# EAGLE design pcb (EAGLE 9.2.2)
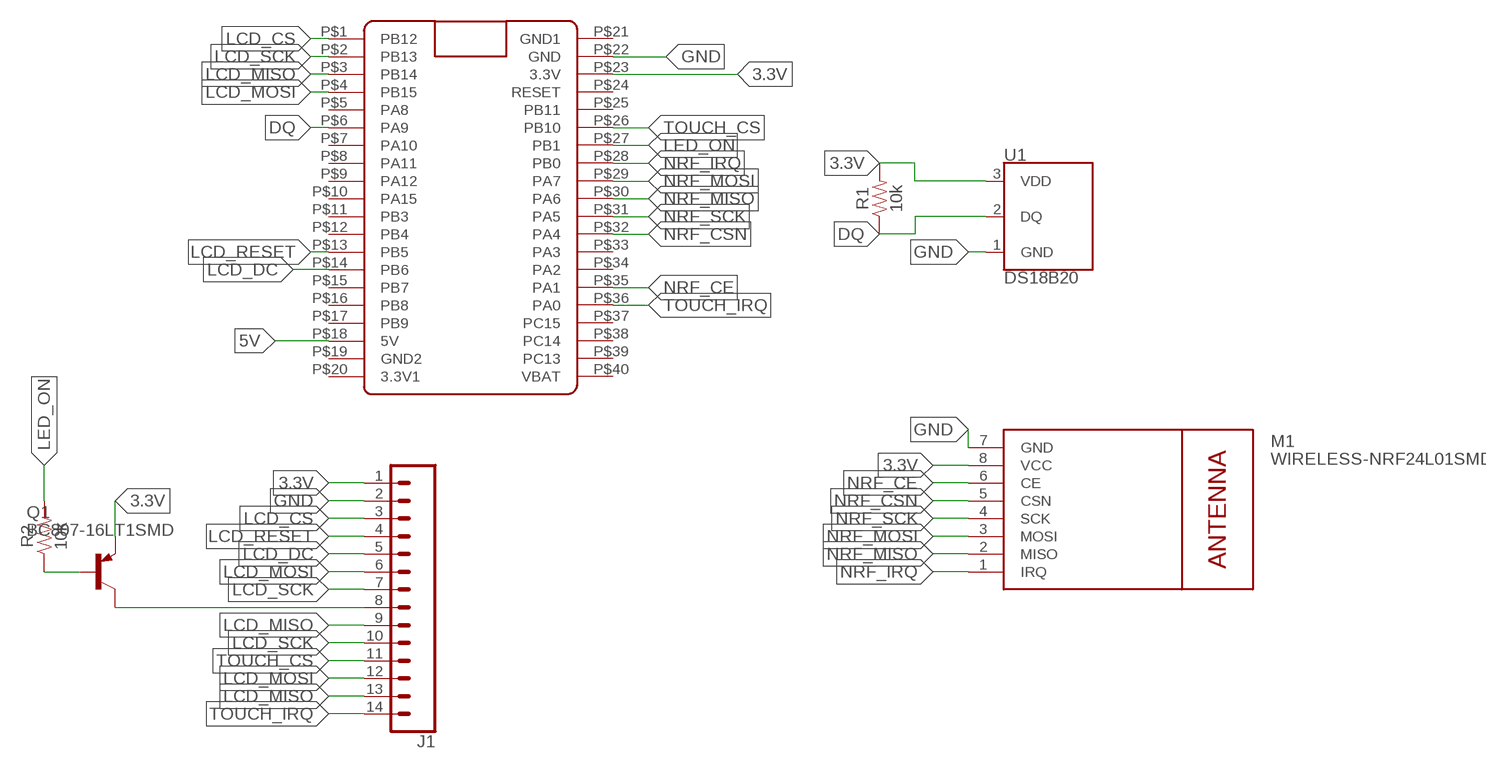
[diagram p0: schematic, sheet 1]

## Parts
J1  CONN_14  [1X14]
M1  WIRELESS-NRF24L01SMD  [WIRELESS-NRF24L01-SMD]
Q1  BC807-16LT1SMD  [SOT23-BEC]
R1  10k  10KOHM-0603-1/10W-1%  [0603]
R2  10k  10KOHM-0603-1/10W-1%  [0603]
U1  DS18B20  [TO-92-AMMO]
U$1  BLUE_PILL  [BLUE_PILL]

## Nets
3.3V: J1.1 M1.8(VCC) Q1.E R1.2 U1.3(VDD) U$1.P$23(3.3V)
5V: U$1.P$18(5V)
DQ: R1.1 U1.2(DQ) U$1.P$6(PA9)
GND: J1.2 M1.7(GND) U1.1(GND) U$1.P$22(GND)
LCD_CS: J1.3 U$1.P$1(PB12)
LCD_DC: J1.5 U$1.P$14(PB6)
LCD_MISO: J1.9 J1.13 U$1.P$3(PB14)
LCD_MOSI: J1.6 J1.12 U$1.P$4(PB15)
LCD_RESET: J1.4 U$1.P$13(PB5)
LCD_SCK: J1.7 J1.10 U$1.P$2(PB13)
LED_ON: R2.2 U$1.P$27(PB1)
N$1: Q1.B R2.1
N$3: J1.8 Q1.C
NRF_CE: M1.6(CE) U$1.P$35(PA1)
NRF_CSN: M1.5(CSN) U$1.P$32(PA4)
NRF_IRQ: M1.1(IRQ) U$1.P$28(PB0)
NRF_MISO: M1.2(MISO) U$1.P$30(PA6)
NRF_MOSI: M1.3(MOSI) U$1.P$29(PA7)
NRF_SCK: M1.4(SCK) U$1.P$31(PA5)
TOUCH_CS: J1.11 U$1.P$26(PB10)
TOUCH_IRQ: J1.14 U$1.P$36(PA0)
Unconnected: U$1.P$5(PA8) U$1.P$7(PA10) U$1.P$8(PA11) U$1.P$9(PA12) U$1.P$10(PA15) U$1.P$11(PB3) U$1.P$12(PB4) U$1.P$15(PB7) U$1.P$16(PB8) U$1.P$17(PB9) U$1.P$19(GND2) U$1.P$20(3.3V1) U$1.P$24(RESET) U$1.P$25(PB11) U$1.P$33(PA3) U$1.P$34(PA2) U$1.P$37(PC15) U$1.P$38(PC14) U$1.P$39(PC13) U$1.P$40(VBAT)

## Power pins joined to a net without a drawn wire
GND1: U$1.P$21(GND1)

## Library data of the parts
J1 = SparkFun-Connectors:CONN_14: Multi connection point. Often used as Generic Header-pin footprint for 0.1 inch spaced/style header connections On any of the 0.1 inch spaced packages, you can populate with these: Break Away Headers - Straight <https://www.sparkfun.com/products/116> (PRT-00116) Break Away Male Headers - Right Angle <https://www.sparkfun.com/products/553> (PRT-00553) Female Headers <https://www.sparkfun.com/products/115> (PRT-00115) Break Away Headers - Machine Pin <https://www.sparkfun.com/products/117> (PRT-00117) Break Away Female Headers - Swiss Machine Pin <https://www.sparkfun.com/products/743> (PRT-00743) For SCREWTERMINALS and SPRING TERMINALS visit here: Screw Terimnals on SparkFun.com <https://www.sparkfun.com/search/results?term=Screw+Terminals> (5mm/3.5mm/2.54mm spacing) This device is also useful as a general connection point to wire up your design to another part of your project. Our various solder wires solder well into these plated through hole pads. Hook-Up Wire - Assortment (Stranded, 22 AWG) <https://www.sparkfun.com/products/11375> (PRT-11375) Hook-Up Wire - Assortment (Solid Core, 22 AWG) <https://www.sparkfun.com/products/11367> (PRT-11367) View the entire wire category on our website here <https://www.sparkfun.com/categories/141> Special notes: Molex polarized connector foot print use with SKU : PRT-08231 with associated crimp pins and housings. 1MM SMD Version SKU: PRT-10208 NOTES ON THE VARIANTS LOCK and LOCK_LONGPADS... This footprint was designed to help hold the alignment of a through-hole component (i.e. 6-pin header) while soldering it into place. You may notice that each hole has been shifted either up or down by 0.005 of an inch from it's more standard position (which is a perfectly straight line). This slight alteration caused the pins (the squares in the middle) to touch the edges of the holes. Because they are alternating, it causes a "brace" to hold the component in place. 0.005 has proven to be the perfect amount of "off-center" position when using our standard breakaway headers. Although looks a little odd when you look at the bare footprint, once you have a header in there, the alteration is very hard to notice. Also,if you push a header all the way into place, it is covered up entirely on the bottom side.
M1 = nrf24l01plus:WIRELESS-NRF24L01: 2.4 GHz Wireless Module based on NRF24L01 chip
Q1 = transistor-pnp:BC807*: PNP Transistror
R1 R2 = SparkFun-Resistors:10KOHM: 10kΩ resistor A resistor is a passive two-terminal electrical component that implements electrical resistance as a circuit element. Resistors act to reduce current flow, and, at the same time, act to lower voltage levels within circuits. - Wikipedia; PROD_ID: RES-00824
U1 = DS18B20:DS18B20: Dallas/Maxim DS18B20 1-Wire Temperature Sensor The DS18B20 reports degrees C with 9 to 12-bit precision, -55C to 125C (+/-0.5C). Each sensor has a unique 64-Bit Serial number etched into it - allows for a huge number of sensors to be used on one data bus. Datasheet <http://datasheets.maximintegrated.com/en/ds/DS18B20.pdf> SparkFun Products One Wire Digital Temperature Sensor - DS18B20 <https://www.sparkfun.com/products/245> (SEN-00245); AVAILABILITY: Unavailable; MF: Maxim Integrated; MP: DS18B20; PACKAGE: TO-92 Maxim Integrated; PRICE: None
U$1 = BluePill:BLUE_PILL

## Board
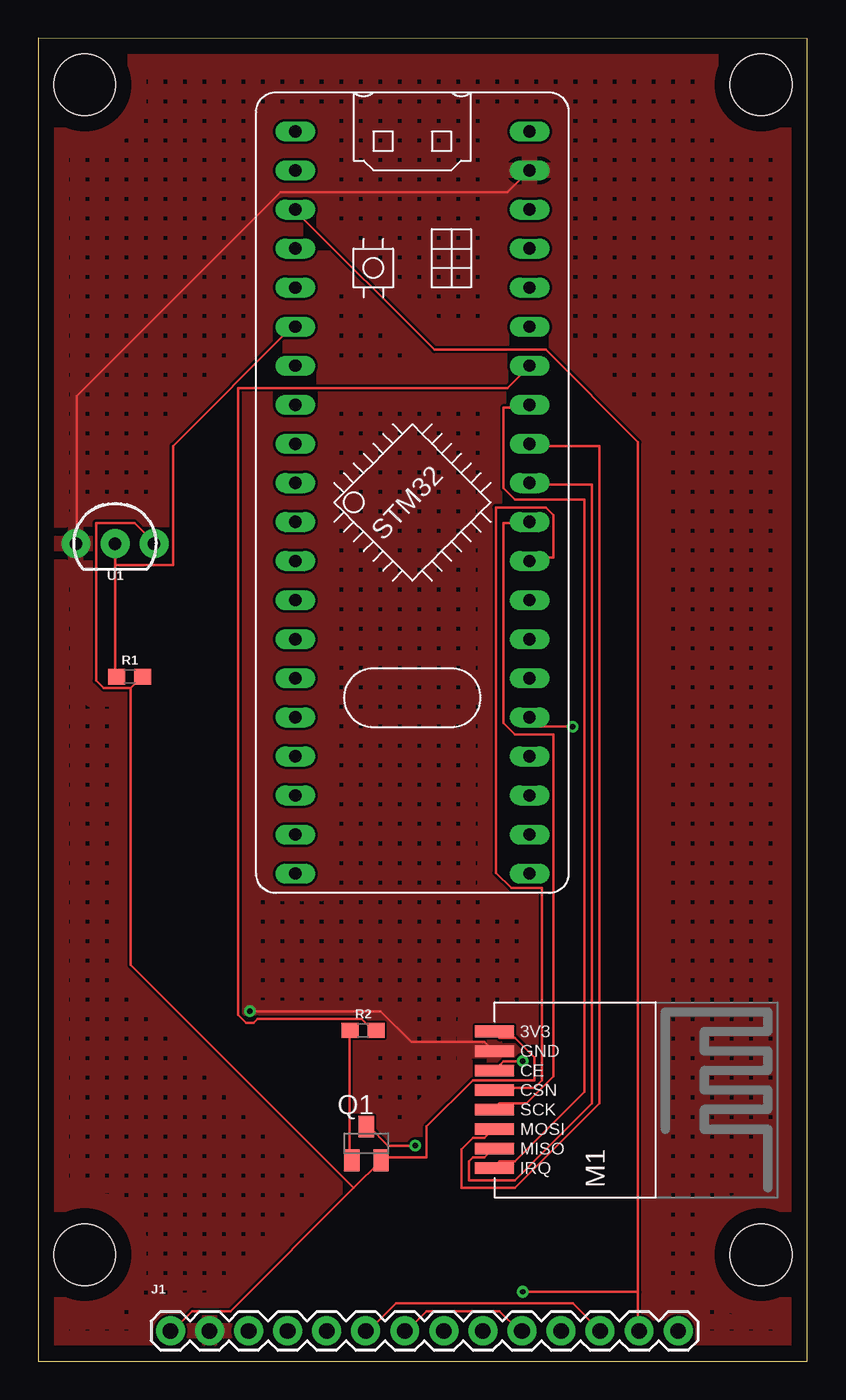
[diagram p1: board, top side]
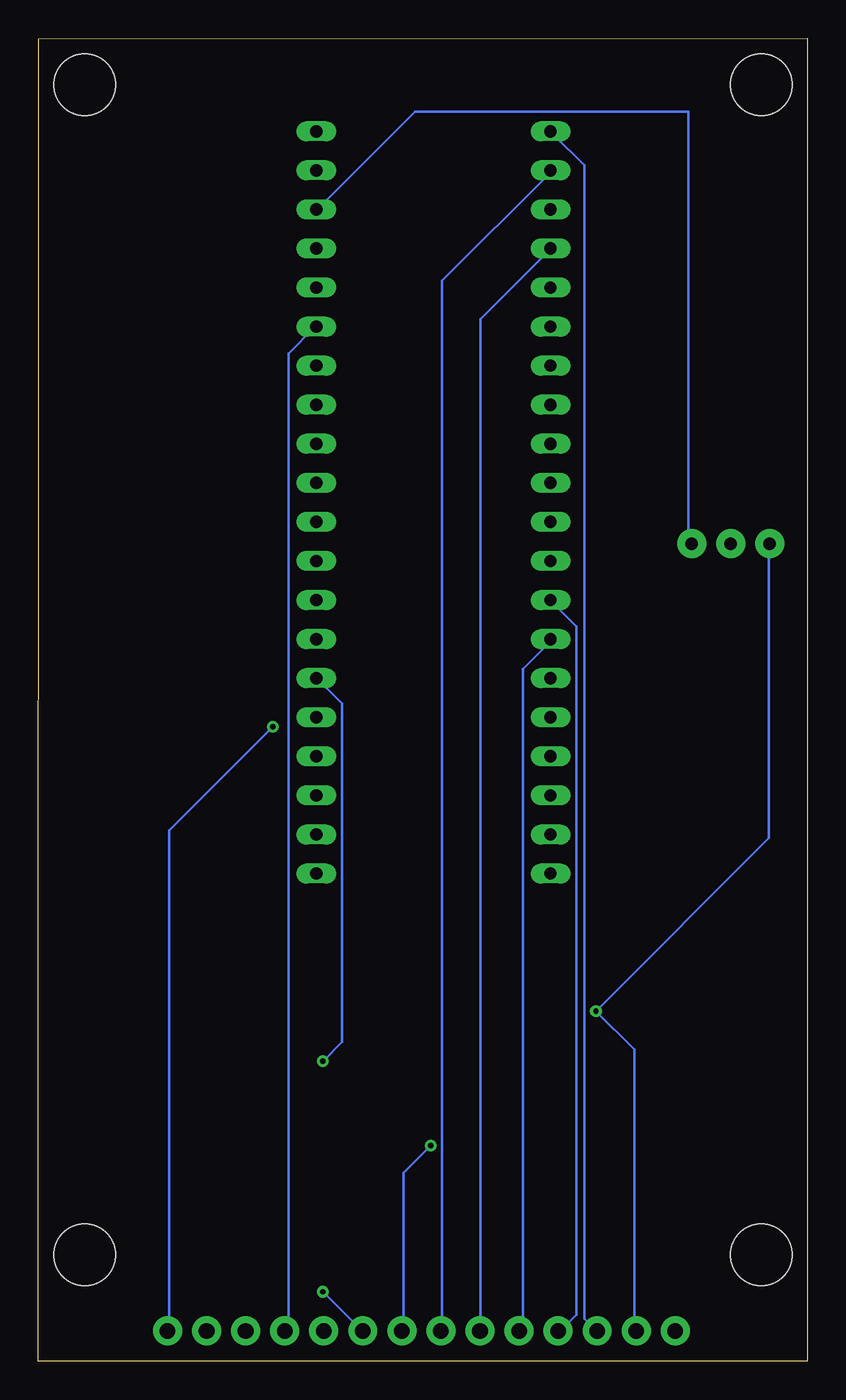
[diagram p2: board, bottom side, seen from below]

Size 50 x 86 mm. Coordinates in mm from the lower left corner, seen from the top.
Outline: 0,86 0,0 50,0 50,85.99 0,86
Copper layers (1*16): Top 0.035mm / dielectric 1.5mm / Bottom 0.035mm
Design rules "default": minimum track width 6mil, minimum drill 0.35mm, track to track 6mil, track to pad 6mil, pad to pad 6mil, via to via 6mil, smd to smd 6mil, copper to edge 40mil, drill to drill 6mil, minimum pad ring 10mil, minimum via ring 8mil, stop-mask expansion 4mil, vias tented up to drill 0mil, thermal gap 10mil
Holes 4 mm at 3,83 47,83 3,6.92 47,6.92

### Footprints (pad centres in the part's own frame; a part is rotated, then mirrored left to right if it is on the bottom)
1X14 = drill 1.016 pad 1.88: 1 0,0; 2 2.54,0; 3 5.08,0; 4 7.62,0; 5 10.16,0; 6 12.7,0; 7 15.24,0; 8 17.78,0; 9 20.32,0; 10 22.86,0; 11 25.4,0; 12 27.94,0; 13 30.48,0; 14 33.02,0
WIRELESS-NRF24L01-SMD = smd 2.54 x 0.762: 1 1.27,0; 2 1.27,1.27; 3 1.27,2.54; 4 1.27,3.81; 5 1.27,5.08; 6 1.27,6.35; 7 1.27,7.62; 8 1.27,8.89
SOT23-BEC = smd 1 x 1.4: B -0.95,-1.1; C 0,1.1; E 0.95,-1.1
0603 = smd 1.1 x 1: 1 -0.85,0; 2 0.85,0
TO-92-AMMO = drill 0.813 pad 1.88: 1 -2.54,0; 2 0,0; 3 2.54,0
BLUE_PILL = drill 0.8 long: P$1 -7.62,15.24; P$2 -7.62,12.7; P$3 -7.62,10.16; P$4 -7.62,7.62; P$5 -7.62,5.08; P$6 -7.62,2.54; P$7 -7.62,0; P$8 -7.62,-2.54; P$9 -7.62,-5.08; P$10 -7.62,-7.62; P$11 -7.62,-10.16; P$12 -7.62,-12.7; P$13 -7.62,-15.24; P$14 -7.62,-17.78; P$15 -7.62,-20.32; P$16 -7.62,-22.86; P$17 -7.62,-25.4; P$18 -7.62,-27.94; P$19 -7.62,-30.48; P$20 -7.62,-33.02; P$21 7.62,15.24; P$22 7.62,12.7; P$23 7.62,10.16; P$24 7.62,7.62; P$25 7.62,5.08; P$26 7.62,2.54; P$27 7.62,0; P$28 7.62,-2.54; P$29 7.62,-5.08; P$30 7.62,-7.62; P$31 7.62,-10.16; P$32 7.62,-12.7; P$33 7.62,-15.24; P$34 7.62,-17.78; P$35 7.62,-20.32; P$36 7.62,-22.86; P$37 7.62,-25.4; P$38 7.62,-27.94; P$39 7.62,-30.48; P$40 7.62,-33.02

### Placement (x,y rotation side)
J1  8.59,1.96 0 top
M1  28.39,12.54 0 top
Q1  21.33,14.15 0 top
R1  5.93,44.5 0 top
R2  21.12,21.5 0 top
U1  4.98,53.15 0 top
U$1  24.32,64.72 0 top

### Tracks (layer width: path | path; a pad name or v marks a point on that pad's centre or on a via)
3.3V
  Top 0.152: 20.5,11.25 12.5,3.25 10,3.25 8.75,2 J1.1 | 20.5,11.25 22.25,13 Q1.E 22.5,13.25 25.25,13.25 25.25,15.25 28.25,18.25 32.25,18.25 32.25,19.75 31,21 30,21 29.75,21.25 M1.8 | 6,43.75 6.75,44.5 R1.2 | 6,43.75 4.25,43.75 3.75,44.25 3.75,54.5 6.25,54.5 7.5,53.25 U1.3 | 20.5,11.25 6,25.75 6,43.75
  Bottom 0.152: U$1.P$23 31.75,75 25.5,81.25 7.75,81.25 7.75,53.25 U1.3
DQ
  Top 0.152: 5,51.75 5,53 U1.2 | 5,51.75 5,44.5 R1.1 | 5,51.75 8.75,51.75 8.75,59.5 16.5,67.25 U$1.P$6
GND  (via drill 0.35)
  Top 0.152: v13.75,22.75 22.25,22.75 24.25,20.75 29,20.75 29.5,20.25 M1.7 | U$1.P$22 31.75,77.25 30.5,76 15.75,76 2.5,62.75 2.5,53.25 U1.1
  Bottom 0.152: J1.2 11.25,2 11.25,20.25 v13.75,22.75 2.5,34 2.5,53 U1.1
  pour Top (hatched): -6,-1 -6,89 54,89 54,-7 -6,-7
LCD_CS
  Bottom 0.152: U$1.P$1 16.5,79.75 14.5,77.75 14.5,2.75 13.75,2 J1.3
LCD_DC
  Bottom 0.152: U$1.P$14 16.75,46.75 18.5,45 18.5,2 J1.5
LCD_MISO  (via drill 0.35)
  Top 0.152: 39,4.5 39,2 J1.13 | 39,4.5 39,59.75 33,65.75 25.75,65.75 16.75,74.75 U$1.P$3 | 39,4.5 v31.5,4.5
  Bottom 0.152: v31.5,4.5 29,2 J1.9
LCD_MOSI
  Top 0.152: J1.12 36.5,2 34.75,3.75 23.25,3.75 21.5,2 J1.6
  Bottom 0.152: U$1.P$4 16.75,72.25 21.25,67.75 21.25,2 J1.6
LCD_RESET
  Bottom 0.152: U$1.P$13 16.5,49.25 15,47.75 15,3 16,2 J1.4
LCD_SCK
  Top 0.152: J1.10 31.25,2 30,3.25 25.25,3.25 24,2 J1.7
  Bottom 0.152: U$1.P$2 16.75,77.25 23.75,70.25 23.75,2 J1.7
LED_ON
  Top 0.152: R2.2 21.75,21.5 21,22.25 14.25,22.25 14,22 13.5,22 13,22.5 13,63.25 30.5,63.25 31.75,64.5 U$1.P$27
N$1
  Top 0.152: R2.1 20.25,21.5 20.25,13.25 Q1.B
N$3  (via drill 0.35)
  Top 0.152: v24.5,14 22.75,14 21.5,15.25 Q1.C
  Bottom 0.152: v24.5,14 26.25,12.25 26.25,2 J1.8
NRF_CE  (via drill 0.35)
  Top 0.152: v31.5,19.5 30.25,19.5 29.75,19 M1.6
  Bottom 0.152: v31.5,19.5 30.25,20.75 30.25,42.75 31.75,44.25 U$1.P$35
NRF_CSN
  Top 0.152: M1.5 29.75,17.75 32.25,17.75 32.75,18.25 32.75,30.75 30.75,30.75 29.75,31.75 29.75,55.5 33,55.5 33.5,55 33.5,52.25 32,52.25 U$1.P$32
NRF_IRQ
  Top 0.152: M1.1 29.75,12.75 30,13 31,13 35.5,17.5 35.5,56 31,56 30.25,56.75 30.25,62 31.75,62 U$1.P$28
NRF_MISO
  Top 0.152: M1.2 29.5,13.75 29,13.25 28.25,13.25 28,13 28,11.75 31,11.75 36,16.75 36,57 32,57 U$1.P$30
NRF_MOSI
  Top 0.152: M1.3 29.5,15 29,14.5 28.25,14.5 27.5,13.75 27.5,11.25 31,11.25 36.5,16.75 36.5,59.5 32,59.5 U$1.P$29
NRF_SCK
  Top 0.152: M1.4 29.75,16.5 30,16.75 31.75,16.75 33.5,18.5 33.5,40.75 31,40.75 30.25,41.5 30.25,54.5 31.75,54.5 U$1.P$31
TOUCH_CS
  Bottom 0.152: U$1.P$26 32,67.25 33.75,65.5 33.75,2 J1.11
TOUCH_IRQ  (via drill 0.35)
  Top 0.152: v34.75,41.25 32.5,41.25 32,41.75 U$1.P$36
  Bottom 0.152: v34.75,41.25 41.5,34.5 41.5,2 J1.14